# Altium schematic sheet Sheet1.SchDoc (part 1 of 2)
size A1; SheetNumber: 1; SheetTotal: 1
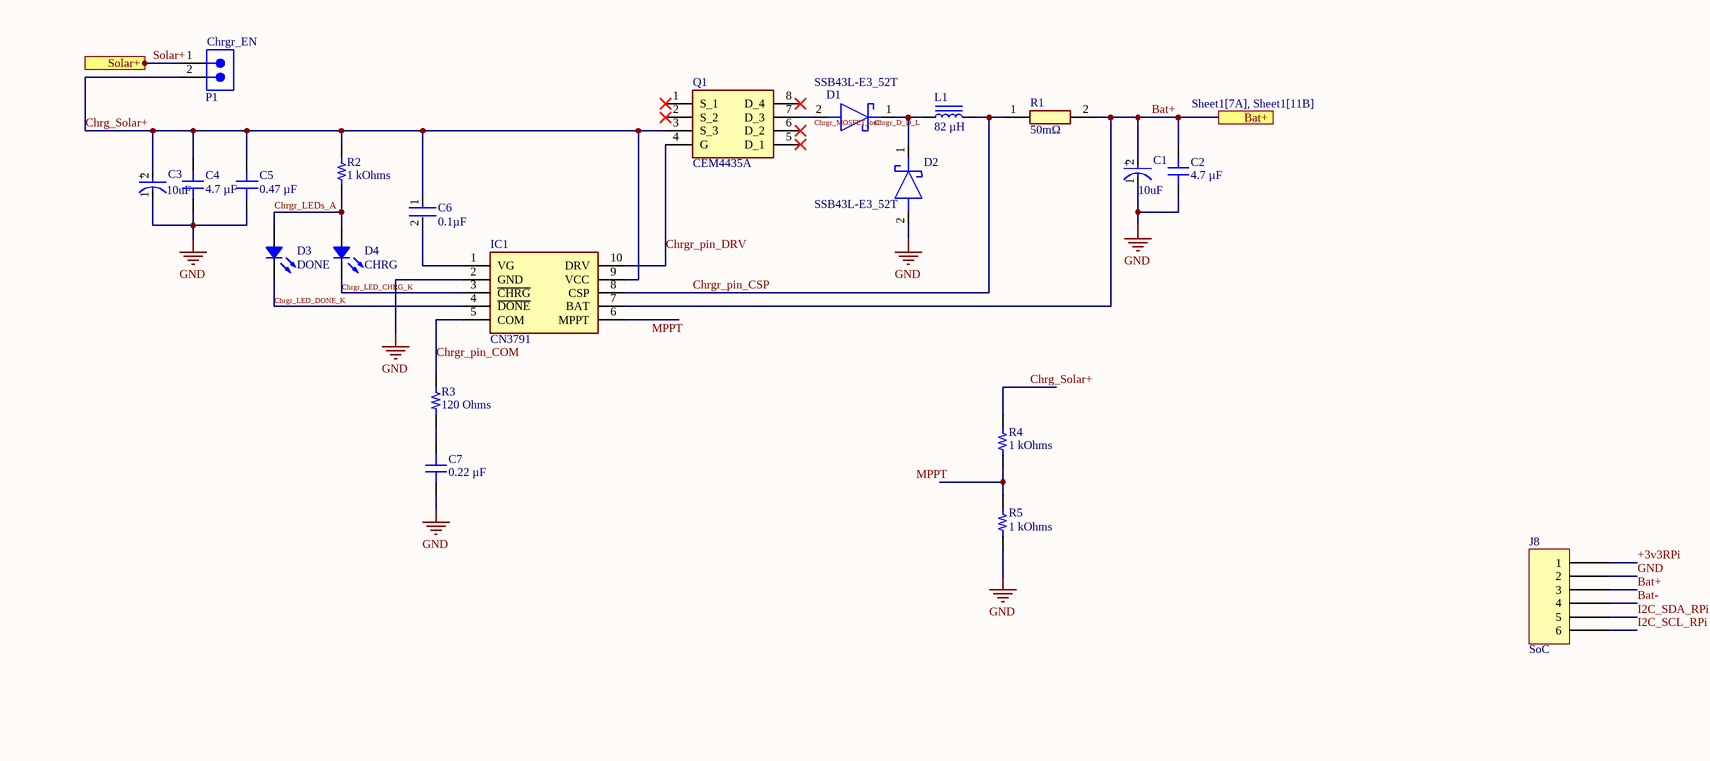
[diagram p0: Sheet1.SchDoc, top left]
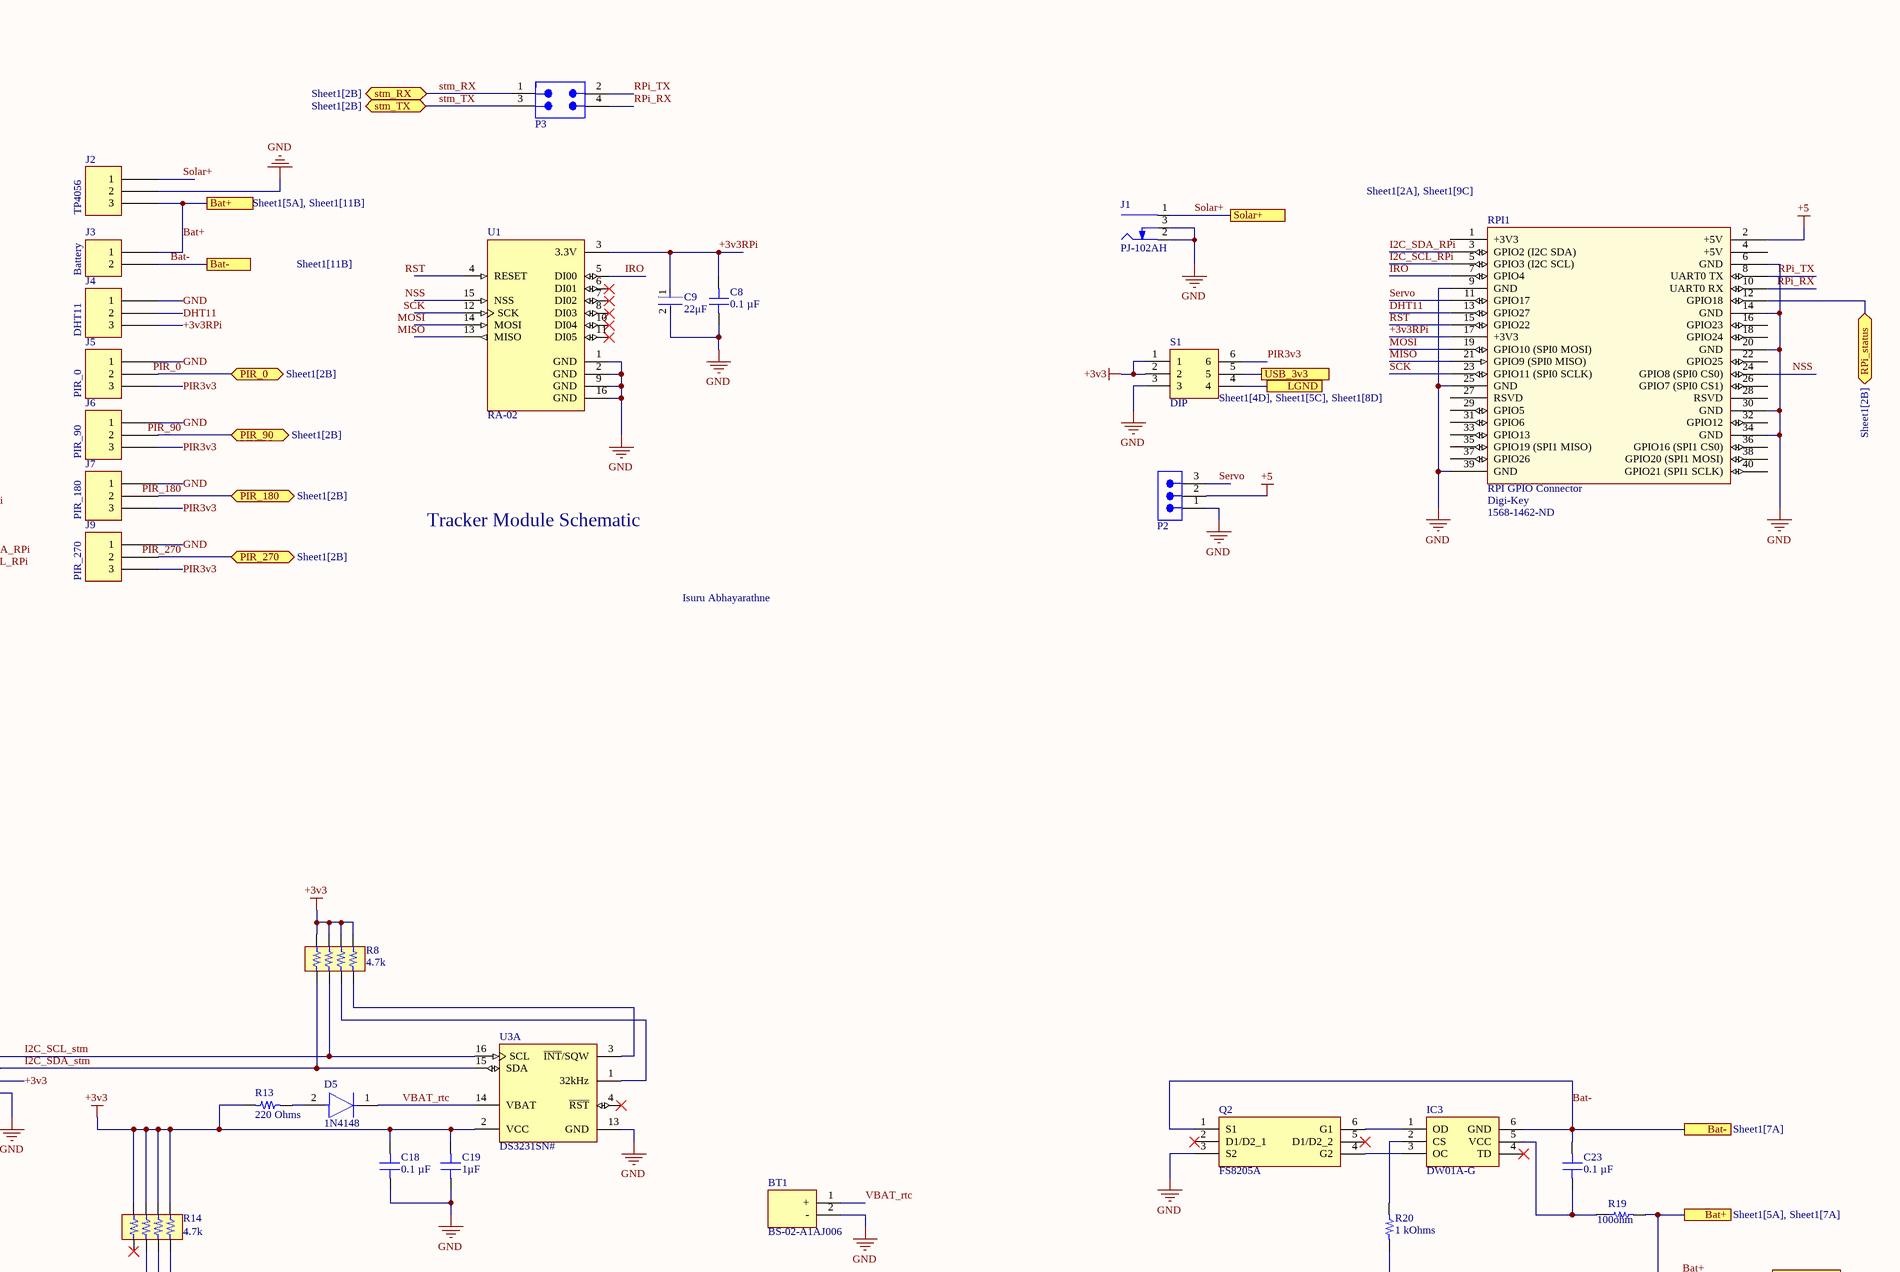
[diagram p1: Sheet1.SchDoc, top right]
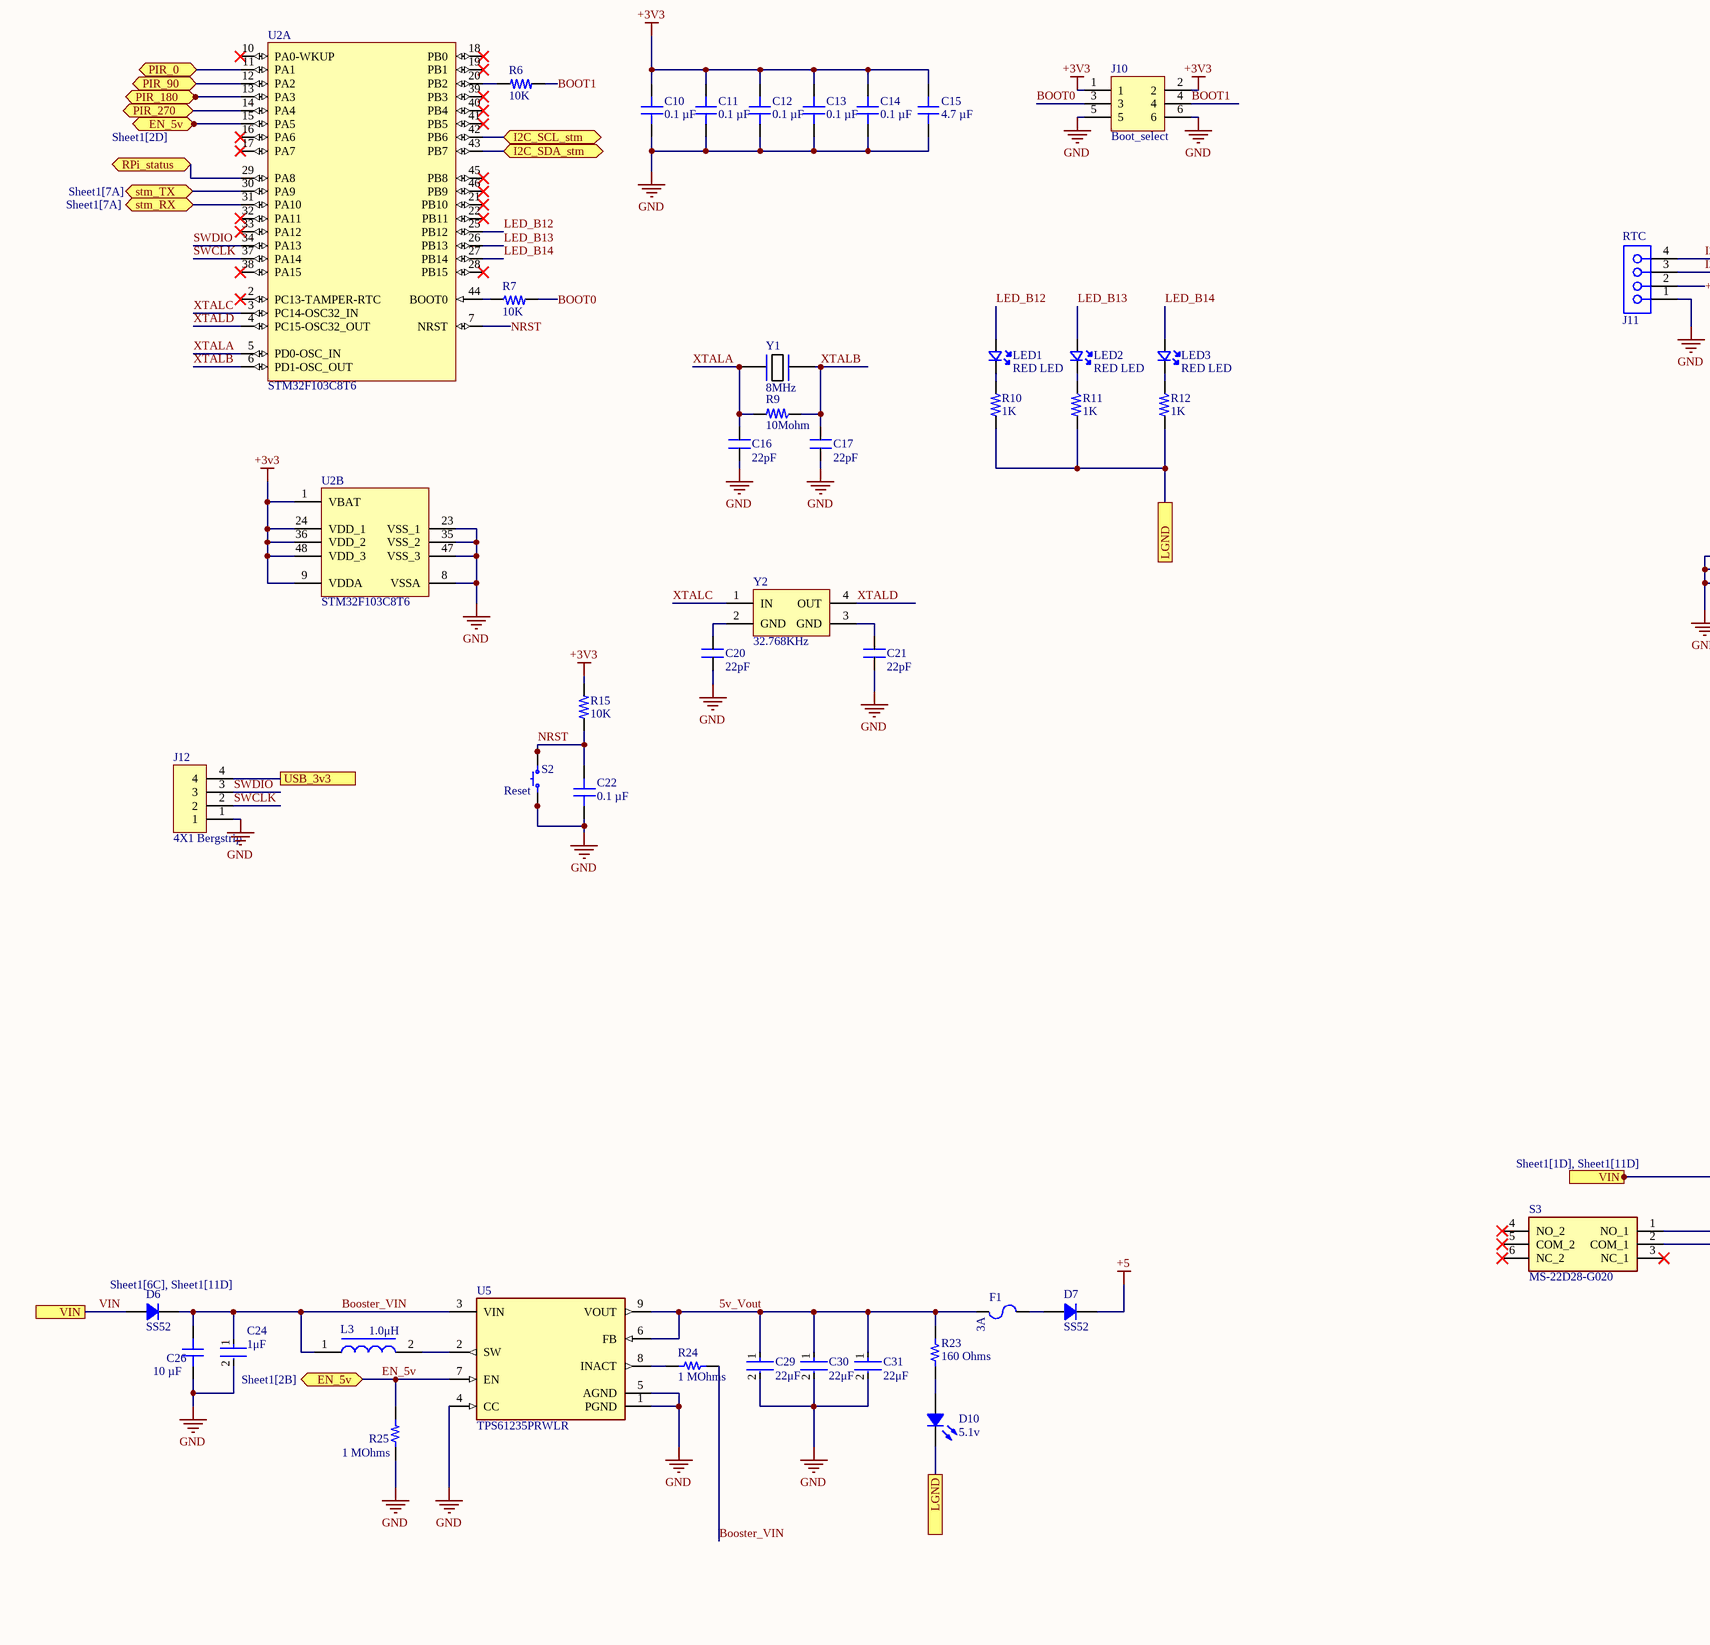
[diagram p2: Sheet1.SchDoc, bottom left]
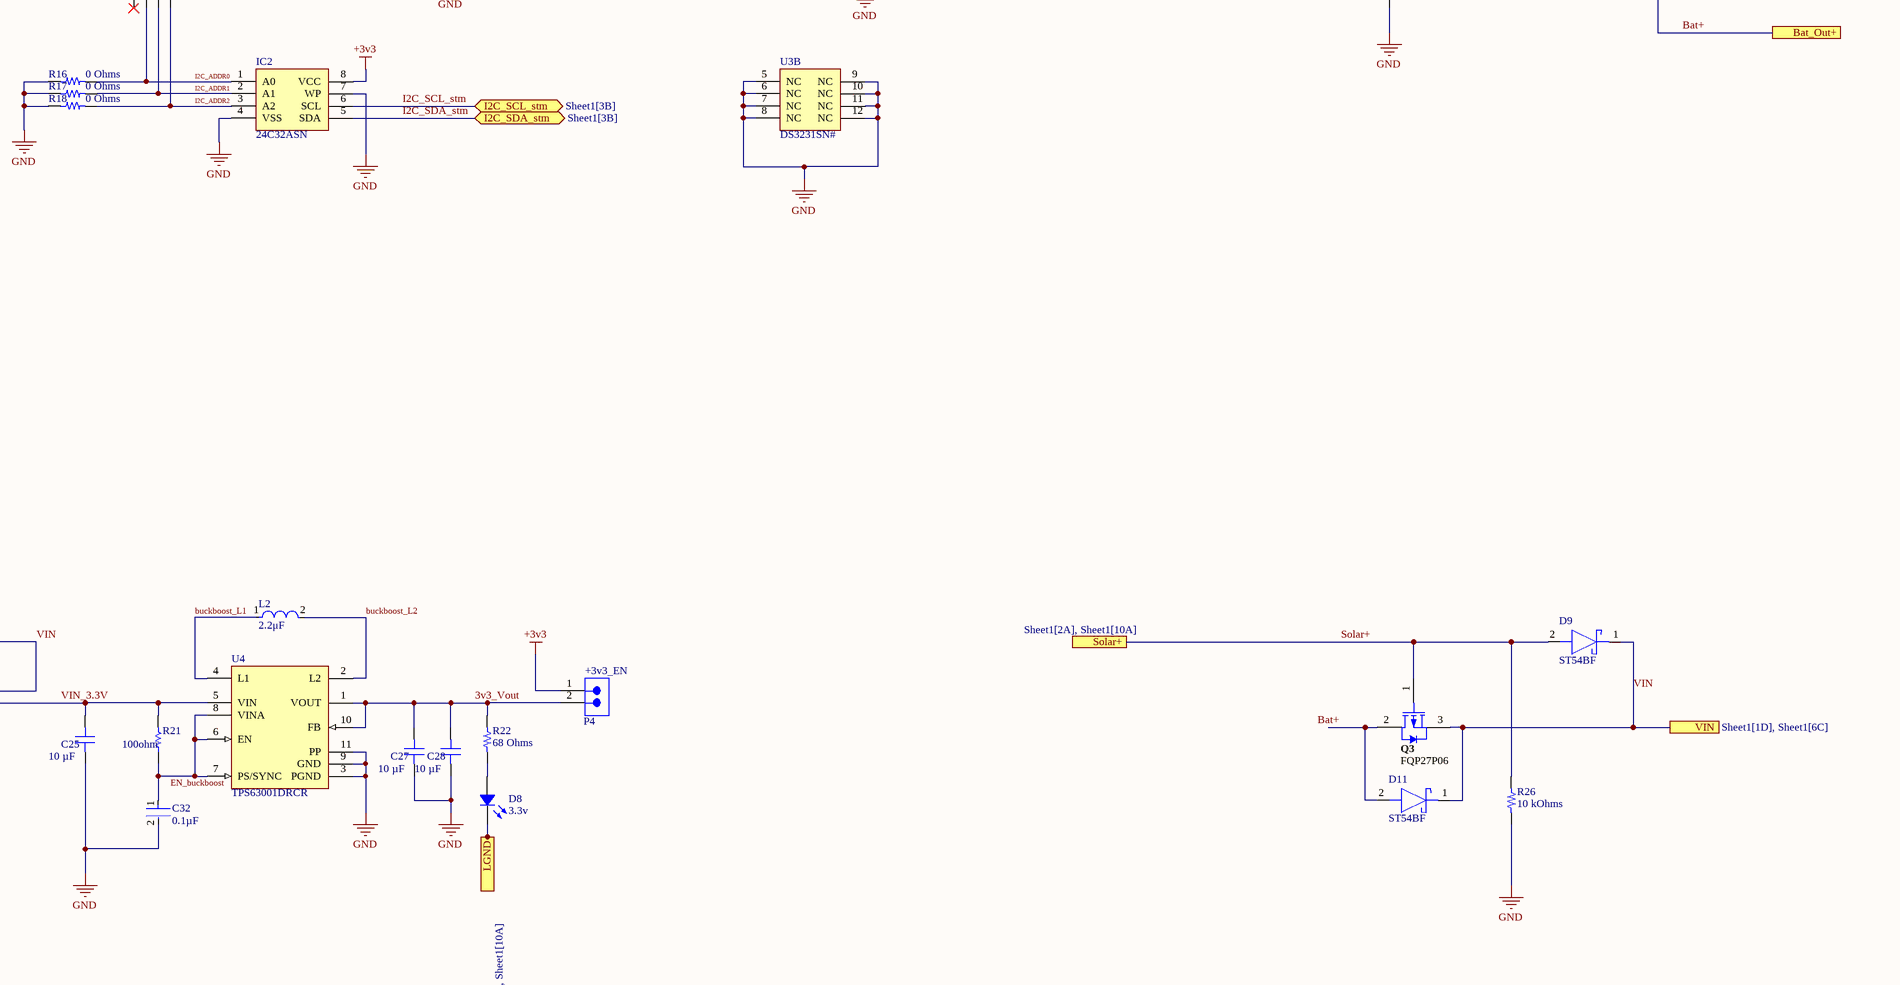
[diagram p3: Sheet1.SchDoc, bottom right]

## Parts
BT1  BS-02-A1AJ006  [BS02A1AJ006]
C1  10uF  [FP-FKC-MFG]
C2  4.7 µF  [CAP 0805_2012]
C3  10uF  [FP-FKC-MFG]
C4  4.7 µF  [CAP 0805_2012]
C5  0.47 µF  [CAP 0805_2012]
C6  0.1µF  [FP-CC0603-DA-MFG]
C7  0.22 µF  [CAP 0603_1608]
C8  0.1 µF  [CAP 0805_2012]
C9  22μF  [FP-GRM21B-0_2-e0_2_0_7-IPC_C]
C10  0.1 µF  [CAP 0805_2012]
C11  0.1 µF  [CAP 0805_2012]
C12  0.1 µF  [CAP 0805_2012]
C13  0.1 µF  [CAP 0805_2012]
C14  0.1 µF  [CAP 0805_2012]
C15  4.7 µF  [CAP 0805_2012]
C16  22pF  [CAP_0805]
C17  22pF  [CAP_0805]
C18  0.1 µF  [CAP 0805_2012]
C19  1µF  [CAP 0805_2012]
C20  22pF  [CAP_0805]
C21  22pF  [CAP_0805]
C22  0.1 µF  [CAP 0805_2012]
C23  0.1 µF  [CAP 0805_2012]
C24  1μF  [FP-0603-L_1_6_0_15-W_0_81-IPC_A]
C25  10 µF  [MURATA GRM188 0603_1608]
C26  10 µF  [MURATA GRM188 0603_1608]
C27  10 µF  [MURATA GRM188 0603_1608]
C28  10 µF  [MURATA GRM188 0603_1608]
C29  22μF  [FP-GRM21B-0_2-e0_2_0_7-IPC_C]
C30  22μF  [FP-GRM21B-0_2-e0_2_0_7-IPC_C]
C31  22μF  [FP-GRM21B-0_2-e0_2_0_7-IPC_C]
C32  0.1µF  [FP-CC0603-DA-MFG]
D1  SSB43L-E3_52T  [DIOM5436X244N]
D2  SSB43L-E3_52T  [DIOM5436X244N]
D3  DONE  [LED 0603_1608 YELLOW]
D4  CHRG  [LED 0603_1608 YELLOW]
D5  1N4148  [FP-6_560-5006_01-4-MFG]
D6  SS52  [DO214AA SMB]
D7  SS52  [DO214AA SMB]
D8  3.3v  [LED 0603_1608 YELLOW]
D9  ST54BF  [DIOM7959X250N]
D10  5.1v  [LED 0603_1608 YELLOW]
D11  ST54BF  [DIOM7959X250N]
F1  3A  [FUSE 1206_3216 0.6MM]
IC1  CN3791  [SOP100P600X175-10N]
IC2  24C32ASN  [SOIC127P600X175-8N]
IC3  DW01A-G  [SOT95P280X135-6N]
J1  PJ-102AH  [CUI PJ-102AH]
J2  TP4056  [JST XH B3B-XH-A]
J3  Battery  [JST XH B2B-XH-A]
J4  DHT11  [JST XH B3B-XH-A]
J5  PIR_0  [JST XH B3B-XH-A]
J6  PIR_90  [JST XH B3B-XH-A]
J7  PIR_180  [JST XH B3B-XH-A]
J8  SoC  [JST XH B6B-XH-A]
J9  PIR_270  [JST XH B3B-XH-A]
J10  Boot_select  [CON6_100_59D78_TH_ST_Duplicate]
J11  RTC  [61300411821]
J12  4X1 Bergstrip  [CON4_100_40D72_TH_ST_MALE]
L1  82 µH  [BOURNS SRR1280]
L2  2.2μF  [FP-LQH3NPH_ME-MFG]
L3  1.0μH  [SPM6530]
LED1  RED LED  [LED_0805]
LED2  RED LED  [LED_0805]
LED3  RED LED  [LED_0805]
P1  Chrgr_EN  [61300211121]
P2  61300311121  [61300311121]  (value not drawn)
P3  61300421121  [61300421121]  (value not drawn)
P4  +3v3_EN  [61300211121]
Q1  CEM4435A  [SOIC127P600X175-8N]
Q2  FS8205A  [SOT95P280X125-6N]
Q3  FQP27P06  [FAIR-TO-220-3]
R1  50mΩ  [RESC6432X65N]
R2  1 kOhms  [RES 0805_2012]
R3  120 Ohms  [RES 0603_1608]
R4  1 kOhms  [RES 0805_2012]
R5  1 kOhms  [RES 0805_2012]
R6  10K  [RES_0805]
R7  10K  [RES_0805]
R8  4.7k  [RESNET 1206-8 CONVEX]
R9  10Mohm  [RES_0805]
R10  1K  [RES_0805]
R11  1K  [RES_0805]
R12  1K  [RES_0805]
R13  220 Ohms  [RES 0805_2012]
R14  4.7k  [RESNET 1206-8 CONVEX]
R15  10K  [RES_0805]
R16  0 Ohms  [RES 0402_1005]
R17  0 Ohms  [RES 0402_1005]
R18  0 Ohms  [RES 0402_1005]
R19  100ohm  [RESC1609X55X30ML10T20]
R20  1 kOhms  [RES 0805_2012]
R21  100ohm  [RESC1609X55X30ML10T20]
R22  68 Ohms  [RES 0603_1608]
R23  160 Ohms  [RES 0603_1608]
R24  1 MOhms  [RES 0603_1608]
R25  1 MOhms  [RES 0603_1608]
R26  10 kOhms  [RES 0805_2012]
RPI1  RPI GPIO Connector  Supplier 1: Digi-Key  Supplier Part Number 1: 1568-1462-ND  [rpi]
S1  DIP  [2193MSTR]
S2  Reset  [OMRON B3FS-1012P]
S3  MS-22D28-G020  [MS22D28G020]
U1  RA-02  [RA-02]
U2  STM32F103C8T6  [STM-LQFP48_L]  (parts A,B of 2)
U3  DS3231SN#  [W16#H2_L]  (parts A,B of 2)
U4  TPS63001DRCR  [DRC0010J_V]
U5  TPS61235PRWLR  [FP-RWL0009A-MFG]
Y1  8MHz  [XTAL_314_240X47_SMD]
Y2  32.768KHz  [XTAL_MC-405 32.7680K-G3]

## Ports
Bat+ (see Sheet1[5A], Sheet1[7A]), Bat+ (see Sheet1[5A], Sheet1[11B]), Bat+ (see Sheet1[7A], Sheet1[11B]), Bat- (see Sheet1[7A]), Bat- (see Sheet1[11B]), Bat_Out+, EN_5v (bidir, see Sheet1[2B]), EN_5v (bidir, see Sheet1[2D]), I2C_SCL_stm (bidir, see Sheet1[3B]), I2C_SCL_stm (bidir, see Sheet1[8C]), I2C_SDA_stm (bidir, see Sheet1[3B]), I2C_SDA_stm (bidir, see Sheet1[8C]), LGND (see Sheet1[4D], Sheet1[5C], Sheet1[8D]), LGND (see Sheet1[4D], Sheet1[5C], Sheet1[10A]), LGND (see Sheet1[4D], Sheet1[8D], Sheet1[10A]), LGND (see Sheet1[5C], Sheet1[8D], Sheet1[10A]), PIR_0 (bidir, see Sheet1[2B]), PIR_0 (bidir, see Sheet1[7A]), PIR_90 (bidir, see Sheet1[2B]), PIR_90 (bidir, see Sheet1[7A]), PIR_180 (bidir, see Sheet1[2B]), PIR_180 (bidir, see Sheet1[7A]), PIR_270 (bidir, see Sheet1[2B]), PIR_270 (bidir, see Sheet1[7B]), RPi_status (bidir, see Sheet1[2B]), RPi_status (bidir, see Sheet1[12A]), Solar+ (see Sheet1[2A], Sheet1[9C]), Solar+ (see Sheet1[2A], Sheet1[10A]), Solar+ (see Sheet1[9C], Sheet1[10A]), stm_RX (bidir, see Sheet1[2B]), stm_RX (bidir, see Sheet1[7A]), stm_TX (bidir, see Sheet1[2B]), stm_TX (bidir, see Sheet1[7A]), USB_3v3 (see Sheet1[2C]), USB_3v3 (see Sheet1[10A]), VIN (see Sheet1[1D], Sheet1[6C]), VIN (see Sheet1[1D], Sheet1[11D]), VIN (see Sheet1[6C], Sheet1[11D])

## Nets
+3v3: C10.2 C11.2 C12.2 C13.2 C14.2 C15.2 C18.2 C19.2 IC2.8(VCC) J10.1 J10.2 J11.2 P4.1 R8.5 R8.6 R8.7 R8.8 R13.1 R14.1 R14.2 R14.3 R14.4 R15.2 S1.1 S1.2 U2.1(VBAT) U2.9(VDDA) U2.24(VDD_1) U2.36(VDD_2) U2.48(VDD_3) U3.2(VCC)
+5: D7.2 P2.2 RPI1.2(+5V)
GND: BT1.2(-) C1.1(C) C2.1 C3.1(C) C4.1 C5.1 C7.1 C8.1 C9.2 C10.1 C11.1 C12.1 C13.1 C14.1 C15.1 C16.1 C17.1 C18.1 C19.1 C20.1 C21.1 C22.1 C24.2 C25.1 C26.1 C27.1 C28.1 C29.2 C30.2 C31.2 C32.2 D2.2(A) IC1.2(GND) IC2.4(VSS) IC2.7(WP) J1.2(Outer) J1.3(SW) J2.2 J4.1 J5.1 J6.1 J7.1 J8.2 J9.1 J10.5 J10.6 J11.1 J12.1 P2.1 Q2.3(S2) R5.1 R16.1 R17.1 R18.1 R20.1 R25.1 R26.2 RPI1.6(GND) RPI1.9(GND) RPI1.14(GND) RPI1.20(GND) RPI1.25(GND) RPI1.30(GND) RPI1.34(GND) RPI1.39(GND) S1.3 S2.1 S2.2 U1.1(GND) U1.2(GND) U1.9(GND) U1.16(GND) U2.8(VSSA) U2.23(VSS_1) U2.35(VSS_2) U2.47(VSS_3) U3.5(NC) U3.6(NC) U3.7(NC) U3.8(NC) U3.9(NC) U3.10(NC) U3.11(NC) U3.12(NC) U3.13(GND) U4.3(PGND) U4.9(GND) U4.11(PP) U5.1(PGND) U5.4(CC) U5.5(AGND)
3v3_Vout: C27.2 C28.2 P4.2 R22.2 U4.1(VOUT) U4.10(FB)
5v_Vout: C29.1 C30.1 C31.1 F1.1 R23.2 U5.6(FB) U5.9(VOUT)
+3v3RPi: C8.2 C9.1 J4.3 J8.1 RPI1.17(+3V3) U1.3(3.3V)
Bat+: C1.2(A) C2.2 D11.2(A) IC1.7(BAT) J2.3 J3.1 J8.3 Q3.2(D) R1.2 R19.2 ; port Bat+, port Bat_Out+
Bat-: C23.2 IC3.6(GND) J3.2 J8.4 Q2.1(S1) ; port Bat-
Booster_VIN: C24.1 C26.2 D6.2 L3.1 R24.1 U5.3(VIN)
BOOT0: J10.3 R7.1
BOOT1: J10.4 R6.1
buckboost_L1: L2.1 U4.4(L1)
buckboost_L2: L2.2 U4.2(L2)
Chrg_Solar+: C3.2(A) C4.2 C5.2 C6.1 IC1.9(VCC) P1.2 Q1.3(S_3) R2.2 R4.2
Chrgr_D_D_L: D1.1(K) D2.1(K) L1.1
Chrgr_LED_CHRG_K: D4.2 IC1.3(~{CHRG})
Chrgr_LED_DONE_K: D3.2 IC1.4(~{DONE})
Chrgr_LEDs_A: D3.1 D4.1 R2.1
Chrgr_MOSFET_out: D1.2(A) Q1.7(D_3)
Chrgr_pin_COM: IC1.5(COM) R3.2
Chrgr_pin_CSP: IC1.8(CSP) L1.2 R1.1
Chrgr_pin_DRV: IC1.10(DRV) Q1.4(G)
DHT11: J4.2 RPI1.13(GPIO27)
EN_5v: R25.2 U2.15(PA5) U5.7(EN) ; port EN_5v
EN_buckboost: C32.1 R21.1 U4.6(EN) U4.7(PS/SYNC) U4.8(VINA)
I2C_ADDR0: IC2.1(A0) R14.6 R16.2
I2C_ADDR1: IC2.2(A1) R14.7 R17.2
I2C_ADDR2: IC2.3(A2) R14.8 R18.2
I2C_SCL_RPi: J8.6 RPI1.5(GPIO3_(I2C_SCL))
I2C_SCL_stm: IC2.6(SCL) J11.4 R8.2 U2.42(PB6) U3.16(SCL) ; port I2C_SCL_stm
I2C_SDA_RPi: J8.5 RPI1.3(GPIO2_(I2C_SDA))
I2C_SDA_stm: IC2.5(SDA) J11.3 R8.1 U2.43(PB7) U3.15(SDA) ; port I2C_SDA_stm
IRO: RPI1.7(GPIO4) U1.5(DI00)
LED_B12: LED1.A U2.25(PB12)
LED_B13: LED2.A U2.26(PB13)
LED_B14: LED3.A U2.27(PB14)
LGND: D8.2 D10.2 R10.1 R11.1 R12.1 S1.4 ; port LGND
MISO: RPI1.21(GPIO9_(SPI0_MISO)) U1.13(MISO)
MOSI: RPI1.19(GPIO10_(SPI0_MOSI)) U1.14(MOSI)
MPPT: IC1.6(MPPT) R4.1 R5.2
NRST: C22.2 R15.1 S2.3 S2.4 U2.7(NRST)
NSS: RPI1.24(GPIO8_(SPI0_CS0)) U1.15(NSS)
PIR3v3: J5.3 J6.3 J7.3 J9.3 S1.6
PIR_0: J5.2 U2.11(PA1) ; port PIR_0
PIR_90: J6.2 U2.12(PA2) ; port PIR_90
PIR_180: J7.2 U2.13(PA3) ; port PIR_180
PIR_270: J9.2 U2.14(PA4) ; port PIR_270
RPi_RX: P3.4 RPI1.10(UART0_RX)
RPi_status: RPI1.12(GPIO18) U2.29(PA8) ; port RPi_status
RPi_TX: P3.2 RPI1.8(UART0_TX)
RST: RPI1.15(GPIO22) U1.4(RESET)
SCK: RPI1.23(GPIO11_(SPI0_SCLK)) U1.12(SCK)
Servo: P2.3 RPI1.11(GPIO17)
Solar+: D9.2(A) J1.1(Centre) J2.1 P1.1 Q3.1(G) R26.1 ; port Solar+
stm_RX: P3.1 U2.31(PA10) ; port stm_RX
stm_TX: P3.3 U2.30(PA9) ; port stm_TX
SWCLK: J12.2 U2.37(PA14)
SWDIO: J12.3 U2.34(PA13)
USB_3v3: J12.4 S1.5 ; port USB_3v3
VBAT_rtc: BT1.1(+) D5.1(C) U3.14(VBAT)
VIN: D6.1 D9.1(K) D11.1(K) Q3.3(S) S3.1(NO_1) ; port VIN
VIN_3.3V: C25.2 R21.2 S3.2(COM_1) U4.5(VIN)
XTALA: C16.2 R9.1 U2.5(PD0-OSC_IN) Y1.1
XTALB: C17.2 R9.2 U2.6(PD1-OSC_OUT) Y1.2
XTALC: U2.3(PC14-OSC32_IN) Y2.1(IN)
XTALD: U2.4(PC15-OSC32_OUT) Y2.4(OUT)
NetC6_2: C6.2 IC1.1(VG)
NetC7_2: C7.2 R3.1
NetC20_2: C20.2 Y2.2(GND)
NetC21_2: C21.2 Y2.3(GND)
NetC23_1: C23.1 IC3.5(VCC) R19.1
NetD5_2: D5.2(A) R13.2
NetD7_1: D7.1 F1.2
NetD8_1: D8.1 R22.1
NetD10_1: D10.1 R23.1
NetIC3_1: IC3.1(OD) Q2.6(G1)
NetIC3_2: IC3.2(CS) R20.2
NetIC3_3: IC3.3(OC) Q2.4(G2)
NetL3_2: L3.2 U5.2(SW)
NetLED1_K: LED1.K R10.2
NetLED2_K: LED2.K R11.2
NetLED3_K: LED3.K R12.2
NetR6_2: R6.2 U2.20(PB2)
NetR7_2: R7.2 U2.44(BOOT0)
NetR8_3: R8.3 U3.1(32kHz)
NetR8_4: R8.4 U3.3(~{INT}/SQW)
NetR24_2: R24.2 U5.8(INACT)

Not connected (* = marked no-connect by the designer): IC3 4(TD)*; Q1 1(S_1)* 2(S_2)* 5(D_1)* 6(D_2)* 8(D_4)*; Q2 2(D1/D2_1)* 5(D1/D2_2)*; R14 5*; RPI1 1(+3V3) 4(+5V) 16(GPIO23) 18(GPIO24) 22(GPIO25) 26(GPIO7_(SPI0_CS1)) 27(RSVD) 28(RSVD) 29(GPIO5) 31(GPIO6) 32(GPIO12) 33(GPIO13) 35(GPIO19_(SPI1_MISO)) 36(GPIO16_(SPI1_CS0)) 37(GPIO26) 38(GPIO20_(SPI1_MOSI)) 40(GPIO21_(SPI1_SCLK)); S3 3(NC_1)* 4(NO_2)* 5(COM_2)* 6(NC_2)*; U1 6(DI01)* 7(DI02)* 8(DI03)* 10(DI04)* 11(DI05)*; U2 2(PC13-TAMPER-RTC)* 10(PA0-WKUP)* 16(PA6)* 17(PA7)* 18(PB0)* 19(PB1)* 21(PB10)* 22(PB11)* 28(PB15)* 32(PA11)* 33(PA12)* 38(PA15)* 39(PB3)* 40(PB4)* 41(PB5)* 45(PB8)* 46(PB9)*; U3 4(~{RST})*

## Notes on the sheet
- Tracker Module Schematic
- Isuru Abhayarathne
- (in symbol CMP-05427-000030-1) +